# Altium project InductiveSensor_LDC1612.PrjPcb (part 1 of 2)
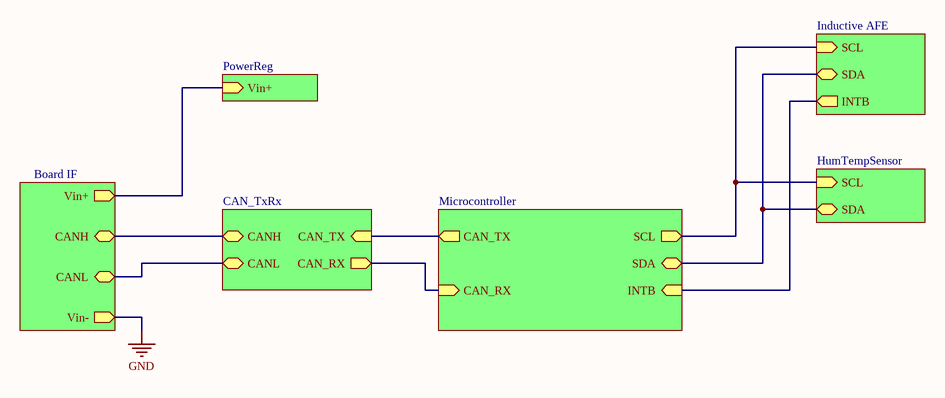
[diagram p0: Sheet1.SchDoc]
7 sheets, 55 parts. Net scope: global (net labels, ports and power ports of the same name join across sheets).
Board files: PCB1.PcbDoc, Coil_only_PCB1.PcbDoc
Sheets:
  Sheet1.SchDoc
    Inductive AFE = Sense_LDC1612.SchDoc
    Microcontroller = Microcontroller_STM32F04.SchDoc
    Board IF = BoardIF.SchDoc
    CAN_TxRx = CAN_TxRx.SchDoc
    PowerReg = PowerReg.SchDoc
    HumTempSensor = HumTempSensor.SchDoc

## Sheet Sheet1.SchDoc
size A; SheetNumber: 1; SheetTotal: 7

### Parts
FID1  Fiducial  [FID]  (value not drawn)
FID2  Fiducial  [FID]  (value not drawn)
FID3  Fiducial  [FID]  (value not drawn)

### Sub-sheets
Board IF = BoardIF.SchDoc: Vin+ (out), CANH (bidir), CANL (bidir), Vin- (out)
CAN_TxRx = CAN_TxRx.SchDoc: CANH (bidir), CANL (bidir), CAN_TX (in), CAN_RX (out)
HumTempSensor = HumTempSensor.SchDoc: SCL (in), SDA (bidir)
Inductive AFE = Sense_LDC1612.SchDoc: SCL (in), SDA (bidir), INTB (out)
Microcontroller = Microcontroller_STM32F04.SchDoc: SDA (bidir), SCL (out), CAN_TX (out), CAN_RX (in), INTB (in)
PowerReg = PowerReg.SchDoc: Vin+ (in)

### Nets
(unnamed): sheet Inductive AFE/SCL, sheet Microcontroller/SCL, sheet HumTempSensor/SCL
(unnamed): sheet Inductive AFE/SDA, sheet Microcontroller/SDA, sheet HumTempSensor/SDA
(unnamed): sheet Inductive AFE/INTB, sheet Microcontroller/INTB
(unnamed): sheet Microcontroller/CAN_TX, sheet CAN_TxRx/CAN_TX
(unnamed): sheet Microcontroller/CAN_RX, sheet CAN_TxRx/CAN_RX
(unnamed): sheet Board IF/Vin+, sheet PowerReg/Vin+
(unnamed): sheet Board IF/CANH, sheet CAN_TxRx/CANH
(unnamed): sheet Board IF/CANL, sheet CAN_TxRx/CANL

## Sheet Sense_LDC1612.SchDoc
size A; SheetNumber: 2; SheetTotal: 7
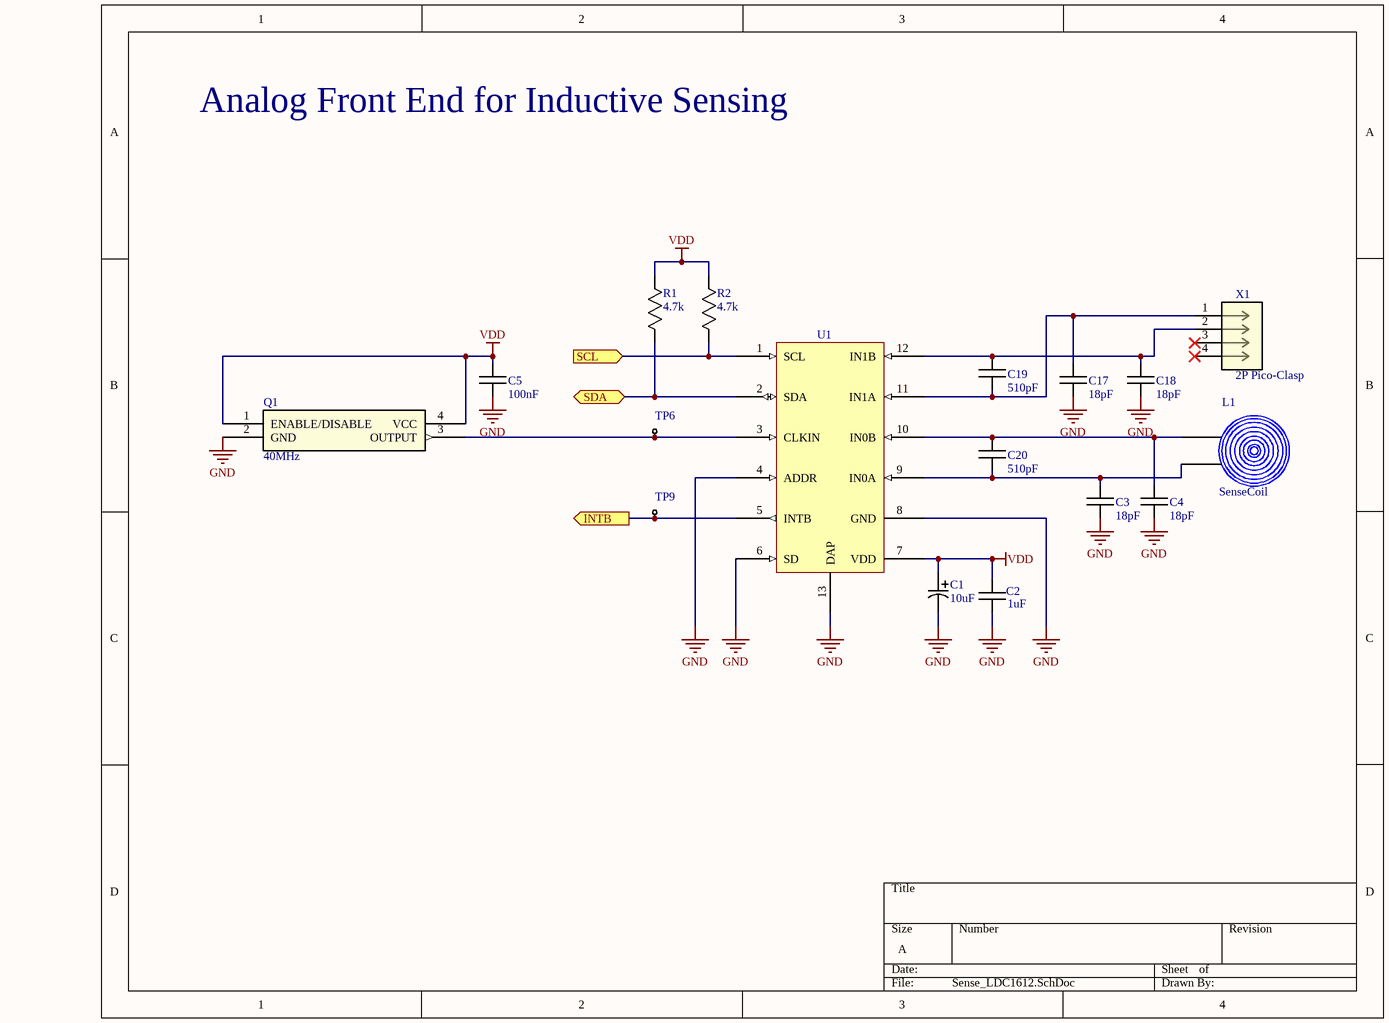
[diagram p1: Sense_LDC1612.SchDoc]

### Parts
C1  10uF  [CAP1206_TAJA]
C2  1uF  [CAP0805]
C3  18pF  [CAP0805]
C4  18pF  [CAP0805]
C5  100nF  [CAP0805]
C17  18pF  [CAP0805]
C18  18pF  [CAP0805]
C19  510pF  [CAP0805]
C20  510pF  [CAP0805]
L1  SenseCoil  [Coil_4L]
Q1  40MHz  [KC2520Z_KYO]
R1  4.7k  [RES0805]
R2  4.7k  [RES0805]
TP6  1mm Test Point  [TP_1MM]  (value not drawn)
TP9  1mm Test Point  [TP_1MM]  (value not drawn)
U1  Inductive Sensor 2Ch  [LDC1612]  (value not drawn)
X1  2P Pico-Clasp  [CON_2023960207]

### Ports
INTB (out, see Microcontroller_STM32F04[2B]), SCL (in, see HumTempSensor[3B], Microcontroller_STM32F04[1B]), SDA (bidir, see HumTempSensor[3B], Microcontroller_STM32F04[1B])

### Nets
GND: C1.2 C2.2 C3.2 C4.2 C5.2 C17.2 C18.2 Q1.2(GND) U1.4(ADDR) U1.6(SD) U1.8(GND) U1.13(DAP)
VDD: C1.1 C2.1 C5.1 Q1.1(ENABLE/DISABLE) Q1.4(VCC) R1.1 R2.1 U1.7(VDD)
NetC3_1: C3.1 C20.1 L1.1 U1.9(IN0A)
NetC4_1: C4.1 C20.2 L1.1 U1.10(IN0B)
NetC17_1: C17.1 C19.1 U1.11(IN1A) X1.1
NetC18_1: C18.1 C19.2 U1.12(IN1B) X1.2
NetQ1_3: Q1.3(OUTPUT) TP6.1 U1.3(CLKIN)
NetR1_2: R1.2 U1.2(SDA) ; port SDA
NetR2_2: R2.2 U1.1(SCL) ; port SCL
NetTP9_1: TP9.1 U1.5(INTB) ; port INTB

Not connected (* = marked no-connect by the designer): X1 3* 4*

### Notes on the sheet
- Analog Front End for Inductive Sensing

### Library data of the parts
C1 = TAJA106K016RNJ: Cap Tant Solid 10uF 16V A CASE 10%( 3.2 X 1.6 X 1.6mm) Inward L SMD 3216-18 3 Ohm 125C T/R; Mfr_Name: KYOCERA AVX; Type: DEV; Dielectric Material: Tantalum; Value: 10uF 16V 10% Tantalum; ESR (Equivalent Series Resistance): 3R; Leakage Current: 1.6uA; Dissipation Factor: 8%; Polarity: Polar; Frequency: 300MHz; Life (Hours): 2000Hour; Ripple Current: 158mA; Copyright: Copyright (C) 2023 Ultra Librarian. All rights reserved.; Manufacturer_Part_Number: TAJA106K016RNJ; RefDes: RefDes; Supplier: Digi-Key; Supplier Part Number: 478-1655-6-ND; Manufacturer: Kyocera AVX; Manufacturer Part Number: TAJA106K016RNJ; RoHS: Yes; Category: Tantalum Capacitors; Stock: 8878; Pricing: 1=0.35, 10=0.234, 50=0.1726, 100=0.1405, 500=0.1109, 1000=0.09365 (USD); Mounting Technology: Surface Mount,PCB; Case/Package: 1206; Pins: 2; Case Code (Metric): 3216; Case Code (Imperial): 1206; Min Operating Temperature: -55°C; Max Operating Temperature: 125°C; Tolerance: 10%; Packaging: Tape and Reel; Voltage Rating: 16V; Voltage Rating (DC): 16V; Features: General Purpose; Series: TAJ; Package Quantity: 1; Termination: SMD/SMT; Voltage: 16V; Construction: Flat; Voltage Rating (AC): 16V; Length: 3.2mm; Width: 1.6mm; Height: 1.6mm; Depth: 1.6mm; Height - Seated (Max): 0.071inch; Lead Pitch: 1.1mm; Size: 1.6mm; Radiation Hardening: No; Lead Free: Lead Free; RoHS Compliant: Yes; Reach SVHC Compliant: No; ComponentLink1URL: https://datasheet.ciiva.com/27051/1234933-27051768.pdf?src-supplier=Jameco; ComponentLink1Description: https://datasheet.ciiva.com/27051/1234933-27051768.pdf?src-supplier=Jameco; ComponentLink2URL: https://datasheet.ciiva.com/26341/559411-da-01-en-tacc-a-3-2-mm-x-1-6-mm-x-1-6-mm-10-uf-26341755.pdf?src-supplier=Conrad; ComponentLink2Description: https://datasheet.ciiva.com/26341/559411-da-01-en-tacc-a-3-2-mm-x-1-6-mm-x-1-6-mm-10-uf-26341755.pdf?src-supplier=Conrad; ComponentLink3URL: https://datasheet.ciiva.com/18710/taj-eng-18710622.pdf?src-supplier=Distrelec; ComponentLink3Description: https://datasheet.ciiva.com/18710/taj-eng-18710622.pdf?src-supplier=Distrelec; ComponentLink4URL: https://datasheet.ciiva.com/7730/1703059-7730712.pdf?src-supplier=Element14; ComponentLink4Description: https://datasheet.ciiva.com/7730/1703059-7730712.pdf?src-supplier=Element14; ComponentLink5URL: https://datasheet.ciiva.com/7730/1703059-7730713.pdf?src-supplier=Element14; ComponentLink5Description: https://datasheet.ciiva.com/7730/1703059-7730713.pdf?src-supplier=Element14; ComponentLink6URL: https://datasheet.ciiva.com/7730/taj-7730975.pdf?src-supplier=Element14; ComponentLink6Description: https://datasheet.ciiva.com/7730/taj-7730975.pdf?src-supplier=Element14; ComponentLink7URL: https://datasheet.ciiva.com/7730/1680476-7730714.pdf?src-supplier=Element14; ComponentLink7Description: https://datasheet.ciiva.com/7730/1680476-7730714.pdf?src-supplier=Element14; ComponentLink8URL: https://datasheet.ciiva.com/263/taj-263392.pdf?src-supplier=Digi-Key; ComponentLink8Description: https://datasheet.ciiva.com/263/taj-263392.pdf?src-supplier=Digi-Key; ComponentLink9URL: https://datasheet.ciiva.com/263/taj-263391.pdf?src-supplier=Digi-Key; ComponentLink9Description: https://datasheet.ciiva.com/263/taj-263391.pdf?src-supplier=Digi-Key; ComponentLink10URL: https://datasheet.ciiva.com/263/taj-263393.pdf?src-supplier=Digi-Key; ComponentLink10Description: https://datasheet.ciiva.com/263/taj-263393.pdf?src-supplier=Digi-Key; ComponentLink11URL: https://datasheet.ciiva.com/12882/taj-27497-12882509.pdf?src-supplier=Mouser; ComponentLink11Description: https://datasheet.ciiva.com/12882/taj-27497-12882509.pdf?src-supplier=Mouser; ComponentLink12URL: https://datasheet.ciiva.com/3004/taj-3004388.pdf?src-supplier=Avnet; ComponentLink12Description: https://datasheet.ciiva.com/3004/taj-3004388.pdf?src-supplier=Avnet; ComponentLink13URL: https://datasheet.ciiva.com/16379/taj-16379015.pdf?src-supplier=Future+Electronics; ComponentLink13Description: https://datasheet.ciiva.com/16379/taj-16379015.pdf?src-supplier=Future+Electronics; ComponentLink14URL: https://datasheet.ciiva.com/3004/taj-3004387.pdf?src-supplier=Avnet; ComponentLink14Description: https://datasheet.ciiva.com/3004/taj-3004387.pdf?src-supplier=Avnet; LCSC Part#: C7171
C2 = CL21B105KBFNNNE: Multilayer Ceramic Capacitor, 1 uF, 50 V, ± 10%, X7R, 0805 [2012 Metric]; Manufacturer: Samsung; Value: 1uF 50V; Voltage Rating: 50V; Dielectric Material: Tantalum; Temperature Coefficient: 0ppm/°C; Supplier: Digi-Key; Supplier Part Number: 1276-1029-1-ND; Manufacturer Part Number: CL21B105KBFNNNE; RoHS: Yes; Category: Ceramic Capacitors; Stock: 1577316; Pricing: 1=0.11, 10=0.075, 50=0.045, 100=0.0354, 500=0.02616, 1000=0.02165 (USD); Mounting Technology: Surface Mount; Case/Package: 0805; Case Code (Metric): 2012; Case Code (Imperial): 0805; Material: Ceramic; Min Operating Temperature: -55°C; Max Operating Temperature: 125°C; Tolerance: 10%; Packaging: Tape and Reel; Package Quantity: 1; Dielectric: X7R; Voltage: 50V; Series: CL; Construction: Flat; Voltage Rating (DC): 50V; Length: 2mm; Width: 0.049inch; Height: 1.25mm; Thickness: 0.053inch; Depth: 1.25mm; Radiation Hardening: No; RoHS Compliant: Yes; ComponentLink1URL: https://datasheet.ciiva.com/25800/cl21b105kbfnnne-25800291.pdf?src-supplier=Digi-Key; ComponentLink1Description: https://datasheet.ciiva.com/25800/cl21b105kbfnnne-25800291.pdf?src-supplier=Digi-Key; Pins: 2; Termination: SMD/SMT; Lead Free: Lead Free; ComponentLink2URL: https://datasheet.ciiva.com/16511/vjw1bcbascomseries-16511277.pdf?src-supplier=Future+Electronics; ComponentLink2Description: https://datasheet.ciiva.com/16511/vjw1bcbascomseries-16511277.pdf?src-supplier=Future+Electronics; ComponentLink3URL: https://datasheet.ciiva.com/176/vjw1bcbascomseries-176732.pdf?src-supplier=Digi-Key; ComponentLink3Description: https://datasheet.ciiva.com/176/vjw1bcbascomseries-176732.pdf?src-supplier=Digi-Key; LCSC Part#: C28323
C3 C4 C17 C18 = VJ0805A180JXACW1BC: 0805 18 pF 50 V ±5 % Tolerance C0G/NP0 SMT Multilayer Ceramic Chip Capacitor; Manufacturer: Vishay; Dielectric Material: Tantalum; Tolerance: 5%; Voltage Rating: 50V; Dielectric: C0G; Temperature Coefficient: 0ppm/°C; Supplier: Digi-Key; Supplier Part Number: 720-1628-1-ND; Manufacturer Part Number: VJ0805A180JXACW1BC; RoHS: Yes; Category: Ceramic Capacitors; Stock: 4074; Pricing: 1=0.2, 10=0.132, 50=0.079, 100=0.0622, 500=0.0459, 1000=0.038 (USD); Mounting Technology: Surface Mount; Case/Package: 0805; Pins: 2; Case Code (Imperial): 0805; Case Code (Metric): 2012; Min Operating Temperature: -55°C; Max Operating Temperature: 125°C; Value: 18pF 50V; Voltage Rating (DC): 50V; Packaging: Tape and Reel; Package Quantity: 4000; Termination: SMD/SMT; Series: VJ; Construction: Flat; Length: 2mm; Width: 1.25mm; Height: 1.45mm; Thickness: 0.03inch; Depth: 1.25mm; Radiation Hardening: No; Lead Free: Lead Free; RoHS Compliant: Yes; ComponentLink1URL: https://datasheet.ciiva.com/16511/vjw1bcbascomseries-16511277.pdf?src-supplier=Future+Electronics; ComponentLink1Description: https://datasheet.ciiva.com/16511/vjw1bcbascomseries-16511277.pdf?src-supplier=Future+Electronics; ComponentLink2URL: https://datasheet.ciiva.com/176/vjw1bcbascomseries-176732.pdf?src-supplier=Digi-Key; ComponentLink2Description: https://datasheet.ciiva.com/176/vjw1bcbascomseries-176732.pdf?src-supplier=Digi-Key; LCSC Part#: C2174299
C5 = CC0805KRX7R9BB104: Multilayer Ceramic Capacitor, 0.1 uF, 50 V, ± 10%, X7R, 0805 [2012 Metric]; Manufacturer: Yageo; Value: 100nF 50V; Voltage: 50V; Insulation Resistance: 100GR; Supplier: Digi-Key; Supplier Part Number: 311-1140-1-ND; Manufacturer Part Number: CC0805KRX7R9BB104; RoHS: Yes; Category: Ceramic Capacitors; Stock: 6426664; Pricing: 1=0.1, 10=0.07, 50=0.0418, 100=0.0329, 500=0.02428, 1000=0.0201 (USD); Mounting Technology: Surface Mount; Case/Package: 0805; Pins: 2; Case Code (Metric): 2012; Case Code (Imperial): 0805; Material: Ceramic; Min Operating Temperature: -55°C; Max Operating Temperature: 125°C; Tolerance: 10%; Dielectric: X7R; Packaging: Tape and Reel; Voltage Rating: 50V; Package Quantity: 4000; Termination: SMD/SMT; Series: CC; Length: 2mm; Height: 0.85mm; Depth: 1.25mm; Radiation Hardening: No; RoHS Compliant: Yes; Reach SVHC Compliant: No; Lead Free: Lead Free; Halogen Free: Halogen Free; ComponentLink1URL: https://datasheet.ciiva.com/11786/0900766b80d84f1d-11786009.pdf?src-supplier=Rs; ComponentLink1Description: https://datasheet.ciiva.com/11786/0900766b80d84f1d-11786009.pdf?src-supplier=Rs; ComponentLink2URL: https://datasheet.ciiva.com/46393/1734573-46393307.pdf?src-supplier=Element14; ComponentLink2Description: https://datasheet.ciiva.com/46393/1734573-46393307.pdf?src-supplier=Element14; ComponentLink3URL: https://datasheet.ciiva.com/155/mlccorderingcode-155930.pdf?src-supplier=Digi-Key; ComponentLink3Description: https://datasheet.ciiva.com/155/mlccorderingcode-155930.pdf?src-supplier=Digi-Key; ComponentLink4URL: https://datasheet.ciiva.com/155/mlccorderingcode-155929.pdf?src-supplier=Digi-Key; ComponentLink4Description: https://datasheet.ciiva.com/155/mlccorderingcode-155929.pdf?src-supplier=Digi-Key; ComponentLink5URL: https://datasheet.ciiva.com/155/mlccorderingcode-155931.pdf?src-supplier=Digi-Key; ComponentLink5Description: https://datasheet.ciiva.com/155/mlccorderingcode-155931.pdf?src-supplier=Digi-Key; ComponentLink6URL: https://datasheet.ciiva.com/11464/upy-gphc-x7r-6-3v-to-50v-8-11464757.pdf?src-supplier=Avnet; ComponentLink6Description: https://datasheet.ciiva.com/11464/upy-gphc-x7r-6-3v-to-50v-8-11464757.pdf?src-supplier=Avnet; ComponentLink7URL: https://datasheet.ciiva.com/28450/1489800-28450805.pdf?src-supplier=Element14; ComponentLink7Description: https://datasheet.ciiva.com/28450/1489800-28450805.pdf?src-supplier=Element14; ComponentLink8URL: https://datasheet.ciiva.com/29242/445210-da-01-en-kerko-chip-0805-x7r-0-1uf-10proz-50vg-29242074.pdf?src-supplier=Conrad; ComponentLink8Description: https://datasheet.ciiva.com/29242/445210-da-01-en-kerko-chip-0805-x7r-0-1uf-10proz-50vg-29242074.pdf?src-supplier=Conrad; LCSC Part#: C49678
C19 C20 = CC0805JRNPO9BN511: 0805 510 pF 50 V ±5 % Tolerance NP0 SMT Multilayer Ceramic Capacitor; Manufacturer: Yageo; Tolerance: 5%; Voltage Rating (DC): 50V; Supplier: Digi-Key; Supplier Part Number: 311-4240-1-ND; Manufacturer Part Number: CC0805JRNPO9BN511; RoHS: Yes; Category: Ceramic Capacitors; Stock: 4065; Pricing: 1=0.18, 10=0.119, 50=0.071, 100=0.0559, 500=0.04124, 1000=0.03415 (USD); Mounting Technology: Surface Mount; Case/Package: 0805; Case Code (Imperial): 0805; Case Code (Metric): 2012; Weight: 0.000194oz; Min Operating Temperature: -55°C; Max Operating Temperature: 125°C; Value: 510pF 50V; Packaging: Tape and Reel; Voltage Rating: 50V; Dielectric: NP0; Termination: SMD/SMT; Series: CC; Length: 0.079inch; Width: 0.049inch; Thickness: 0.028inch; Lead Free: Lead Free; ComponentLink1URL: http://www.mouser.com/ds/2/447/Yageo_UPY-GP_NP0_16V-to-50V_9-358835.pdf?src-supplier=Mouser; ComponentLink1Description: http://www.mouser.com/ds/2/447/Yageo_UPY-GP_NP0_16V-to-50V_9-358835.pdf?src-supplier=Mouser; ComponentLink2URL: https://www.yageo.com/upload/media/product/productsearch/datasheet/mlcc/UPY-GP_NP0_16V-to-50V_18.pdf?src-supplier=Digi-Key; ComponentLink2Description: https://www.yageo.com/upload/media/product/productsearch/datasheet/mlcc/UPY-GP_NP0_16V-to-50V_18.pdf?src-supplier=Digi-Key; ComponentLink3URL: http://www.yageo.com/documents/recent/UPY-GP_NP0_16V-to-50V_16.pdf?src-supplier=Digi-Key; ComponentLink3Description: http://www.yageo.com/documents/recent/UPY-GP_NP0_16V-to-50V_16.pdf?src-supplier=Digi-Key; ComponentLink4URL: http://www.yageo.com/exep/pages/download/literatures/ProductSelectionGuide%202014_Final_2.pdf?src-supplier=Digi-Key; ComponentLink4Description: http://www.yageo.com/exep/pages/download/literatures/ProductSelectionGuide%202014_Final_2.pdf?src-supplier=Digi-Key; ComponentLink5URL: http://www.yageo.com/documents/recent/UPY-GP_NP0_16V-to-50V_9.pdf?src-supplier=Future+Electronics; ComponentLink5Description: http://www.yageo.com/documents/recent/UPY-GP_NP0_16V-to-50V_9.pdf?src-supplier=Future+Electronics; ComponentLink6URL: https://datasheet.octopart.com/CC0805JRNPO9BN511-Yageo-datasheet-151948684.pdf?src-supplier=Newark; ComponentLink6Description: https://datasheet.octopart.com/CC0805JRNPO9BN511-Yageo-datasheet-151948684.pdf?src-supplier=Newark; LCSC Part#: C309486
Q1 = KC2520Z40.0000C15XXK: Xtal Osc Xo 40.0000MHZ Cmos SMD; Manufacturer: Kyocera AVX; Supplier: Digi-Key; Supplier Part Number: 478-KC2520Z40.0000C15XXKCT-ND; Manufacturer Part Number: KC2520Z40.0000C15XXK; RoHS: No; Category: Oscillators; Stock: 9175; Pricing: 1=1.16, 10=1.107, 50=1.0816, 100=0.927, 500=0.90124, 1000=0.75962 (USD); LCSC Part#: C1857241; Value: KC2520Z40.0000C15XXK
R1 R2 = ERJ-6GEYJ472V: Res Thick Film 0805 4.7K Ohm 5% 1/8W ±200ppm/°C Molded SMD Punched Carrier T/R; Manufacturer: Panasonic; Value: 4.7kR; Power Rating: 125mW; Voltage Rating: 150V; Supplier: Digi-Key; Supplier Part Number: P4.7KACT-ND; Manufacturer Part Number: ERJ-6GEYJ472V; RoHS: Yes; Category: Chip SMD Resistors; Stock: 148739; Pricing: 1=0.1, 10=0.038, 50=0.0244, 100=0.0206, 500=0.01434, 1000=0.01248 (USD); Mounting Technology: Surface Mount; Case/Package: 0805; Case Code (Metric): 2012; Case Code (Imperial): 0805; Contact Plating: Tin; Min Operating Temperature: -55°C; Max Operating Temperature: 155°C; Tolerance: 5%; Packaging: Tape and Reel; Package Quantity: 1; Termination: SMD/SMT; Max Power Dissipation: 125mW; Series: ERJ; Resistance Tolerance: 5%; Resistor Type: Thick Film; Number of Terminations: 2; Temperature Coefficient: 200ppm/°C; Construction: Rectangular; Technology: THICK FILM; Voltage Rating (DC): 150V; Length: 2mm; Width: 1.25mm; Height: 0.6mm; Depth: 1.25mm; Radiation Hardening: No; Reach SVHC Compliant: No; RoHS Compliant: Yes; Military Standard: Not; Lead Free: Lead Free; LCSC Part#: C230645
TP6 TP9 = TestPoint_1mm
U1 = LDC1612: 2-Ch, 28-bit, high-resolution Inductance to digital converter 12-WSON -40 to 125; Manufacturer: Texas Instruments; Manufacturer Part Number: LDC1612DNTR; Interface: I2C; Number of Inputs: 2; Value: LDC1612DNTR; Package: WSON-12; Supplier: Digi-Key; Supplier Part Number: 296-LDC1612DNCT-ND; RoHS: Yes; Category: Integrated Circuits (ICs); Stock: 21433; Pricing: 1=3.68, 10=3.305, 25=3.1248, 100=2.7081, 250=2.5692, 500=2.30532, 1000=1.94425 (USD); Mounting Technology: Surface Mount; Pins: 12; Min Operating Temperature: -40°C; Max Operating Temperature: 125°C; Series: *; Packaging: Tape and Reel; Number of Channels: 2; Lead Free: Lead Free; RoHS Compliant: Yes; ComponentLink2URL: http://www.ti.com/general/docs/suppproductinfo.tsp?distId=10&amp;gotoUrl=http%3A%2F%2Fwww.ti.com%2Flit%2Fgpn%2Fldc1612&src-supplier=Digi-Key; ComponentLink2Description: http://www.ti.com/general/docs/suppproductinfo.tsp?distId=10&amp;gotoUrl=http%3A%2F%2Fwww.ti.com%2Flit%2Fgpn%2Fldc1612&src-supplier=Digi-Key; ComponentLink3URL: http://www.ti.com/general/docs/lit/getliterature.tsp?genericPartNumber=LDC1614&&fileType=pdf&src-supplier=Avnet; ComponentLink3Description: http://www.ti.com/general/docs/lit/getliterature.tsp?genericPartNumber=LDC1614&&fileType=pdf&src-supplier=Avnet; ComponentLink4URL: http://www.ti.com/lit/gpn/ldc1612?src-supplier=Mouser; ComponentLink4Description: http://www.ti.com/lit/gpn/ldc1612?src-supplier=Mouser; LCSC Part#: C1847959
X1 = 202396-0207: Conn Shrouded Header (4 Sides) HDR 2 POS 1mm Solder RA Side Entry SMD Pico-Clasp™ T/R; Manufacturer: Molex; Number of Positions: 2; Value: 2023960207; Supplier: Digi-Key; Supplier Part Number: WM26783CT-ND; Manufacturer Part Number: 202396-0207; RoHS: No; Category: Headers and Wire Housings; Stock: 6710; Pricing: 1=0.97, 10=0.804, 100=0.6698 (USD); Mounting Technology: Surface Mount; Contact Material: Bronze; Contact Shape: Square; Insulation Material: Nylon; Insulation Color: Natural; Contact Finish - Mating: GOLD; Min Operating Temperature: -40°C; Max Operating Temperature: 105°C; Connector Type: Header; Fastening Type: Latch; Packaging: Tape and Reel; Number of Rows: 1; Termination: Solder; Series: Pico-Clasp 202396; Contact Type: Male Pin; Flammability Rating: UL94 V-0; ComponentLink1URL: http://datasheet.octopart.com/2023960207-Molex-datasheet-147952241.pdf?src-supplier=Digi-Key; ComponentLink1Description: http://datasheet.octopart.com/2023960207-Molex-datasheet-147952241.pdf?src-supplier=Digi-Key; ComponentLink2URL: https://www.molex.com/pdm_docs/sd/2023960207_sd.pdf?src-supplier=Digi-Key; ComponentLink2Description: https://www.molex.com/pdm_docs/sd/2023960207_sd.pdf?src-supplier=Digi-Key; ComponentLink3URL: http://datasheet.octopart.com/2023960207-Molex-datasheet-147952241.pdf?src-supplier=Newark; ComponentLink3Description: http://datasheet.octopart.com/2023960207-Molex-datasheet-147952241.pdf?src-supplier=Newark; ComponentLink4URL: http://datasheet.octopart.com/2023960207-Molex-datasheet-147952241.pdf?src-supplier=Farnell; ComponentLink4Description: http://datasheet.octopart.com/2023960207-Molex-datasheet-147952241.pdf?src-supplier=Farnell; ComponentLink5URL: http://datasheet.octopart.com/2023960207-Molex-datasheet-147952241.pdf?src-supplier=Avnet; ComponentLink5Description: http://datasheet.octopart.com/2023960207-Molex-datasheet-147952241.pdf?src-supplier=Avnet; ComponentLink6URL: http://datasheet.octopart.com/2023960207-Molex-datasheet-147952241.pdf?src-supplier=Arrow+Electronics; ComponentLink6Description: http://datasheet.octopart.com/2023960207-Molex-datasheet-147952241.pdf?src-supplier=Arrow+Electronics; ComponentLink7URL: http://datasheet.octopart.com/2023960207-Molex-datasheet-147952241.pdf?src-supplier=TTI; ComponentLink7Description: http://datasheet.octopart.com/2023960207-Molex-datasheet-147952241.pdf?src-supplier=TTI; ComponentLink8URL: http://datasheet.octopart.com/2023960207-Molex-datasheet-147952241.pdf?src-supplier=Electro+Sonic; ComponentLink8Description: http://datasheet.octopart.com/2023960207-Molex-datasheet-147952241.pdf?src-supplier=Electro+Sonic; ComponentLink9URL: https://datasheet.octopart.com/202396-0207-Molex-datasheet-134623761.pdf?src-supplier=TME; ComponentLink9Description: https://datasheet.octopart.com/202396-0207-Molex-datasheet-134623761.pdf?src-supplier=TME; LCSC Part#: C585325

## Sheet Microcontroller_STM32F04.SchDoc
size A; SheetNumber: 3; SheetTotal: 7
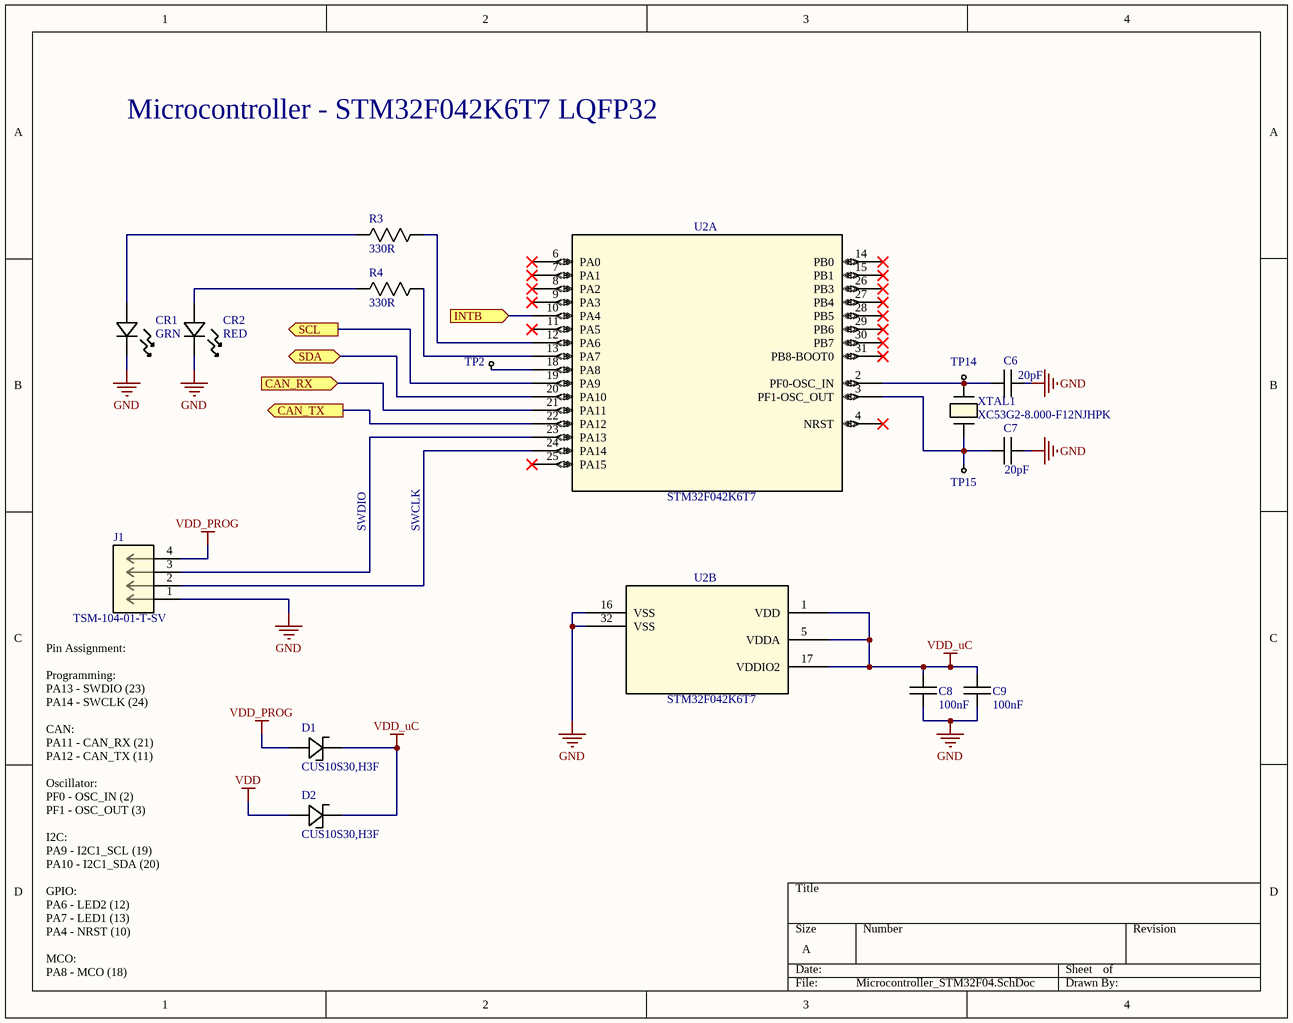
[diagram p2: Microcontroller_STM32F04.SchDoc]

### Parts
C6  20pF  [C0603]
C7  20pF  [C0603]
C8  100nF  [CAP0805]
C9  100nF  [CAP0805]
CR1  GRN  [LED_VISHAY_VLMX1300_VIS]
CR2  RED  [LED_VISHAY_VLMX1300_VIS]
D1  CUS10S30,H3F  [USC_TOS]
D2  CUS10S30,H3F  [USC_TOS]
J1  TSM-104-01-T-SV  [CONN_TSM-104-01-T-SV_SAI]
R3  330R  [R0603]
R4  330R  [R0603]
TP2  1mm Test Point  [TP_1MM]  (value not drawn)
TP14  1mm Test Point  [TP_1MM]  (value not drawn)
TP15  1mm Test Point  [TP_1MM]  (value not drawn)
U2  STM32F042K6T7  [LQFP-32]  (parts A,B of 2)
XTAL1  XC53G2-8.000-F12NJHPK  [XTAL_NX5032_NDK]

### Ports
CAN_RX (in, see CAN_TxRx[2B]), CAN_TX (out, see CAN_TxRx[2B]), INTB (in, see Sense_LDC1612[2C]), SCL (out, see HumTempSensor[3B], Sense_LDC1612[2B]), SDA (bidir, see HumTempSensor[3B], Sense_LDC1612[2B])

### Nets
GND: C6.1 C7.1 C8.2 C9.2 CR1.1 CR2.1 J1.1 U2.16(VSS) U2.32(VSS)
VDD: D2.2(anode)
VDD_PROG: D1.2(anode) J1.4
VDD_uC: C8.1 C9.1 D1.1(cathode) D2.1(cathode) U2.1(VDD) U2.5(VDDA) U2.17(VDDIO2)
NetC6_2: C6.2 TP14.1 U2.2(PF0-OSC_IN) XTAL1.2
NetC7_2: C7.2 TP15.1 U2.3(PF1-OSC_OUT) XTAL1.1
NetCR1_2: CR1.2 R3.2
NetCR2_2: CR2.2 R4.2
NetJ1_2: J1.2 U2.24(PA14)
NetJ1_3: J1.3 U2.23(PA13)
NetR1_2: U2.20(PA10) ; port SDA
NetR2_2: U2.19(PA9) ; port SCL
NetR3_1: R3.1 U2.12(PA6)
NetR4_1: R4.1 U2.13(PA7)
NetTP2_1: TP2.1 U2.18(PA8)
NetTP9_1: U2.10(PA4) ; port INTB
NetTP20_1: U2.21(PA11) ; port CAN_RX
NetTP26_1: U2.22(PA12) ; port CAN_TX

Not connected (* = marked no-connect by the designer): U2 4(NRST)* 6(PA0)* 7(PA1)* 8(PA2)* 9(PA3)* 11(PA5)* 14(PB0)* 15(PB1)* 25(PA15)* 26(PB3)* 27(PB4)* 28(PB5)* 29(PB6)* 30(PB7)* 31(PB8-BOOT0)*

### Notes on the sheet
- Microcontroller - STM32F042K6T7 LQFP32
- SWDIO
- SWCLK
- (near J1) Pin Assignment:
  Programming:
  PA13 - SWDIO (23)
  PA14 - SWCLK (24)
  CAN:
  PA11 - CAN_RX (21)
  PA12 - CAN_TX (11)
  Oscillator:
  PF0 - OSC_IN (2)
  PF1 - OSC_OUT (3)
  I2C:
  PA9 - I2C1_SCL (19)
  PA10 - I2C1_SDA (20)
  GPIO:
  PA6 - LED2 (12)
  PA7 - LED1 (13)
  PA4 - NRST (10)
  MCO:
  PA8 - MCO (18)

### Library data of the parts
C6 C7 = CL10C200JB8NNNC: Multilayer Ceramic Capacitor, 20 pF, 50 V, ± 5%, C0G (NP0), 0603 [1608 Metric]; Manufacturer: Samsung; Value: 20pF 50V; Voltage Rating: 50V; Temperature Coefficient: 300ppm/°C; Supplier: Digi-Key; Supplier Part Number: 1276-1187-1-ND; Manufacturer Part Number: CL10C200JB8NNNC; RoHS: Yes; Category: Ceramic Capacitors; Stock: 379574; Pricing: 1=0.1, 10=0.041, 50=0.0238, 100=0.0184, 500=0.01386, 1000=0.01089 (USD); Mounting Technology: Surface Mount; Case/Package: 0603; Case Code (Metric): 1608; Case Code (Imperial): 0603; Min Operating Temperature: -55°C; Max Operating Temperature: 125°C; Tolerance: 5%; Dielectric: C0G; Package Quantity: 1; Packaging: Tape and Reel; Voltage: 50V; Series: CL; Construction: Flat; Voltage Rating (DC): 50V; Length: 1.6mm; Width: 0.031inch; Height: 0.8mm; Thickness: 0.035inch; Depth: 0.8mm; Radiation Hardening: No; RoHS Compliant: Yes; ComponentLink1URL: https://datasheet.ciiva.com/26877/getdatasheetpartid-640634-26877974.pdf?src-supplier=Verical; ComponentLink1Description: https://datasheet.ciiva.com/26877/getdatasheetpartid-640634-26877974.pdf?src-supplier=Verical; ComponentLink2URL: https://datasheet.ciiva.com/26310/mlcc-catalogdownload2013-eng-26310315.pdf?src-supplier=Distrelec; ComponentLink2Description: https://datasheet.ciiva.com/26310/mlcc-catalogdownload2013-eng-26310315.pdf?src-supplier=Distrelec; LCSC Part#: C1648
C8 C9 = CC0805KRX7R9BB104: as C5 on sheet Sense_LDC1612; Supplier: Digi-Key; Supplier Part Number: 311-1140-1-ND; Manufacturer Part Number: CC0805KRX7R9BB104; RoHS: Yes; Category: Ceramic Capacitors; Stock: 6426664; Pricing: 1=0.1, 10=0.07, 50=0.0418, 100=0.0329, 500=0.02428, 1000=0.0201 (USD); Mounting Technology: Surface Mount; Case/Package: 0805; Pins: 2; Case Code (Metric): 2012; Case Code (Imperial): 0805; Material: Ceramic; Min Operating Temperature: -55°C; Max Operating Temperature: 125°C; Tolerance: 10%; Dielectric: X7R; Packaging: Tape and Reel; Voltage Rating: 50V; Package Quantity: 4000; Termination: SMD/SMT; Series: CC; Length: 2mm; Height: 0.85mm; Depth: 1.25mm; Radiation Hardening: No; RoHS Compliant: Yes; Reach SVHC Compliant: No; Lead Free: Lead Free; Halogen Free: Halogen Free; ComponentLink1URL: https://datasheet.ciiva.com/11786/0900766b80d84f1d-11786009.pdf?src-supplier=Rs; ComponentLink1Description: https://datasheet.ciiva.com/11786/0900766b80d84f1d-11786009.pdf?src-supplier=Rs; ComponentLink2URL: https://datasheet.ciiva.com/46393/1734573-46393307.pdf?src-supplier=Element14; ComponentLink2Description: https://datasheet.ciiva.com/46393/1734573-46393307.pdf?src-supplier=Element14; ComponentLink3URL: https://datasheet.ciiva.com/155/mlccorderingcode-155930.pdf?src-supplier=Digi-Key; ComponentLink3Description: https://datasheet.ciiva.com/155/mlccorderingcode-155930.pdf?src-supplier=Digi-Key; ComponentLink4URL: https://datasheet.ciiva.com/155/mlccorderingcode-155929.pdf?src-supplier=Digi-Key; ComponentLink4Description: https://datasheet.ciiva.com/155/mlccorderingcode-155929.pdf?src-supplier=Digi-Key; ComponentLink5URL: https://datasheet.ciiva.com/155/mlccorderingcode-155931.pdf?src-supplier=Digi-Key; ComponentLink5Description: https://datasheet.ciiva.com/155/mlccorderingcode-155931.pdf?src-supplier=Digi-Key; ComponentLink6URL: https://datasheet.ciiva.com/11464/upy-gphc-x7r-6-3v-to-50v-8-11464757.pdf?src-supplier=Avnet; ComponentLink6Description: https://datasheet.ciiva.com/11464/upy-gphc-x7r-6-3v-to-50v-8-11464757.pdf?src-supplier=Avnet; ComponentLink7URL: https://datasheet.ciiva.com/28450/1489800-28450805.pdf?src-supplier=Element14; ComponentLink7Description: https://datasheet.ciiva.com/28450/1489800-28450805.pdf?src-supplier=Element14; ComponentLink8URL: https://datasheet.ciiva.com/29242/445210-da-01-en-kerko-chip-0805-x7r-0-1uf-10proz-50vg-29242074.pdf?src-supplier=Conrad; ComponentLink8Description: https://datasheet.ciiva.com/29242/445210-da-01-en-kerko-chip-0805-x7r-0-1uf-10proz-50vg-29242074.pdf?src-supplier=Conrad; LCSC Part#: C49678
CR1 = VLMG1300-GS08: LED Uni-Color Yellow Green 574nm 2-Pin Chip 0603(1608Metric) T/R; Mfr_Name: Vishay; Manufacturer: Vishay Semiconductors; Type: DEV; Color: Green,Yellow; Lens Style: Rectangular,Clear; Forward Voltage: 2V; Viewing Angle: 130°; Luminous Intensity: 35mcd; Forward Current: 20mA; Wavelength: 571nm; Power Rating: 75mW; Number of Elements: 1; Reverse Voltage: 5V; Value: LED Green; Copyright: Copyright (C) 2023 Ultra Librarian. All rights reserved.; Manufacturer_Part_Number: VLMG1300-GS08; RefDes: RefDes; Supplier: Digi-Key; Supplier Part Number: VLMG1300-GS08CT-ND; Manufacturer Part Number: VLMG1300-GS08; RoHS: Yes; Category: LEDs; Stock: 55201; Pricing: 1=0.3, 10=0.237, 100=0.1065, 500=0.09616, 1000=0.07898 (USD); Mounting Technology: Surface Mount; Case/Package: 0603; Pins: 2; Case Code (Metric): 1608; Case Code (Imperial): 0603; Min Operating Temperature: -35°C; Max Operating Temperature: 85°C; Packaging: Tape and Reel; Illumination Color: Green,Yellow; Package Quantity: 1; Dominant Wavelength: 571nm; Test Current: 20mA; Power Dissipation: 75mW; Number of LEDs: 1; Series: CHipLED; Length: 1.6mm; Width: 0.8mm; Height: 0.8mm; Depth: 0.8mm; Radiation Hardening: No; Lead Free: Lead Free; RoHS Compliant: Yes; Reach SVHC Compliant: Unknown; ComponentLink1URL: https://datasheet.ciiva.com/26322/vlmo1300-26322139.pdf?src-supplier=Element14; ComponentLink1Description: https://datasheet.ciiva.com/26322/vlmo1300-26322139.pdf?src-supplier=Element14; ComponentLink2URL: https://datasheet.ciiva.com/26322/vlmo1300-26322140.pdf?src-supplier=Element14; ComponentLink2Description: https://datasheet.ciiva.com/26322/vlmo1300-26322140.pdf?src-supplier=Element14; ComponentLink3URL: https://datasheet.ciiva.com/8028/vlmo1300-8028023.pdf?src-supplier=Element14; ComponentLink3Description: https://datasheet.ciiva.com/8028/vlmo1300-8028023.pdf?src-supplier=Element14; ComponentLink4URL: https://datasheet.ciiva.com/9333/vlmo1300-9333390.pdf?src-supplier=Avnet; ComponentLink4Description: https://datasheet.ciiva.com/9333/vlmo1300-9333390.pdf?src-supplier=Avnet; LCSC Part#: C4749244
CR2 = VLMS1300-GS08: LED RED 0603 SMD; Mfr_Name: Vishay; Manufacturer: Vishay Semiconductors; Type: DEV; Viewing Angle: 130°; Lens Style: Rectangular,Clear; Number of LEDs: 1; Luminous Intensity: 54mcd; Forward Voltage: 2V; Wavelength: 631nm; Forward Current: 20mA; Power Rating: 75mW; Value: LED Red; Copyright: Copyright (C) 2023 Ultra Librarian. All rights reserved.; Manufacturer_Part_Number: VLMS1300-GS08; RefDes: RefDes; Supplier: Digi-Key; Supplier Part Number: VLMS1300-GS08CT-ND; Manufacturer Part Number: VLMS1300-GS08; RoHS: Yes; Category: LEDs; Stock: 28800; Pricing: 1=0.28, 10=0.223, 100=0.1002, 500=0.0905, 1000=0.07434 (USD); Mounting Technology: Surface Mount; Case/Package: 0603; Color: Red; Case Code (Metric): 1608; Case Code (Imperial): 0603; Min Operating Temperature: -35°C; Max Operating Temperature: 85°C; Package Quantity: 1; Packaging: Tape and Reel; Illumination Color: Red; Dominant Wavelength: 631nm; Test Current: 20mA; Series: CHipLED; Length: 1.6mm; Width: 0.8mm; Height: 0.8mm; Radiation Hardening: No; Lead Free: Lead Free; RoHS Compliant: Yes; Reach SVHC Compliant: Unknown; ComponentLink1URL: https://datasheet.ciiva.com/26322/vlmo1300-26322153.pdf?src-supplier=Element14; ComponentLink1Description: https://datasheet.ciiva.com/26322/vlmo1300-26322153.pdf?src-supplier=Element14; ComponentLink2URL: https://datasheet.ciiva.com/8028/vlmo1300-8028047.pdf?src-supplier=Element14; ComponentLink2Description: https://datasheet.ciiva.com/8028/vlmo1300-8028047.pdf?src-supplier=Element14; ComponentLink3URL: https://datasheet.ciiva.com/9333/vlmo1300-9333743.pdf?src-supplier=Avnet; ComponentLink3Description: https://datasheet.ciiva.com/9333/vlmo1300-9333743.pdf?src-supplier=Avnet; ComponentLink4URL: https://datasheet.ciiva.com/16510/vlmo1300-16510985.pdf?src-supplier=Future+Electronics; ComponentLink4Description: https://datasheet.ciiva.com/16510/vlmo1300-16510985.pdf?src-supplier=Future+Electronics; ComponentLink5URL: https://datasheet.ciiva.com/2114/vlmo1300-2114930.pdf?src-supplier=Digi-Key; ComponentLink5Description: https://datasheet.ciiva.com/2114/vlmo1300-2114930.pdf?src-supplier=Digi-Key; ComponentLink6URL: https://datasheet.ciiva.com/2114/vlmo1300-2114931.pdf?src-supplier=Digi-Key; ComponentLink6Description: https://datasheet.ciiva.com/2114/vlmo1300-2114931.pdf?src-supplier=Digi-Key; ComponentLink7URL: https://datasheet.ciiva.com/2114/vlmo1300-2114929.pdf?src-supplier=Digi-Key; ComponentLink7Description: https://datasheet.ciiva.com/2114/vlmo1300-2114929.pdf?src-supplier=Digi-Key; LCSC Part#: C83242
D1 D2 = CUS10S30,H3F: Rectifier Diode, Schottky, 1 Phase, 1 Element, 1A, 30V V(RRM), Silicon; Mfr_Name: Toshiba Electronic Devices & Storage Corp.; Manufacturer: Toshiba; Type: DEV; Max Reverse Current: 500uA; Peak Non-Repetitive Surge Current: 5A; Copyright: Copyright (C) 2023 Ultra Librarian. All rights reserved.; Manufacturer_Part_Number: CUS10S30,H3F; RefDes: RefDes; Supplier: Digi-Key; Supplier Part Number: CUS10S30H3FCT-ND; Manufacturer Part Number: CUS10S30,H3F; RoHS: Yes; Category: Rectifier Diodes; Stock: 308991; Pricing: 1=0.35, 10=0.243, 100=0.1228, 500=0.1002, 1000=0.07434 (USD); Mounting Technology: Surface Mount; Case/Package: SOD; Pins: 2; Contact Plating: Tin,Silver; Min Operating Temperature: -55°C; Max Operating Temperature: 125°C; Packaging: Cut Tape; Average Rectified Current: 1A; Max Reverse Voltage (DC): 30V; Series: -; RoHS Compliant: Yes; ComponentLink1URL: http://toshiba.semicon-storage.com/info/lookup.jsp?pid=CUS10S30&amp;lang=en&src-supplier=Mouser; ComponentLink1Description: http://toshiba.semicon-storage.com/info/lookup.jsp?pid=CUS10S30&amp;lang=en&src-supplier=Mouser; ComponentLink2URL: http://toshiba.semicon-storage.com/info/docget.jsp?did=14077&prodName=CUS10S30&src-supplier=Avnet; ComponentLink2Description: http://toshiba.semicon-storage.com/info/docget.jsp?did=14077&prodName=CUS10S30&src-supplier=Avnet; ComponentLink3URL: https://toshiba.semicon-storage.com/info/docget.jsp?did=14077&prodName=CUS10S30&src-supplier=Digi-Key; ComponentLink3Description: https://toshiba.semicon-storage.com/info/docget.jsp?did=14077&prodName=CUS10S30&src-supplier=Digi-Key; LCSC Part#: C146335; Value: CUS10S30,H3F
J1 = TSM-104-01-T-SV: Conn Unshrouded Header HDR 4 POS 2.54mm Solder ST Top Entry SMD Tube; Mfr_Name: Samtec Inc; Manufacturer: Samtec; Number of Contacts: 4; Gender: Male; Max Current Rating: 7A; Max Voltage Rating (AC): 475V; Copyright: Copyright (C) 2023 Ultra Librarian. All rights reserved.; Manufacturer_Part_Number: TSM-104-01-T-SV; RefDes: RefDes; Type: DEV; Supplier: Digi-Key; Supplier Part Number: SAM8983-ND; Manufacturer Part Number: TSM-104-01-T-SV; RoHS: Yes; Category: Headers and Wire Housings; Stock: 1177; Pricing: 1=0.65, 10=0.564, 100=0.4646, 500=0.404, 1000=0.3333, 5000=0.2929, 10000=0.2727 (USD); Mounting Technology: Surface Mount; Contact Plating: Tin; Contact Material: Bronze; Contact Shape: Square; Contact Finish - Mating: TIN; Insulation Material: Polymer; Insulation Color: Black; Housing Color: Black; Housing Material: Polymer; Color: Black; Min Operating Temperature: -55°C; Max Operating Temperature: 105°C; Number of Rows: 1; Packaging: Rail/Tube; Termination: Solder; Number of Positions: 4; Series: TSM; Contact Type: Male Pin; Connector Type: Header; Fastening Type: Pull; Orientation: Straight; Package Quantity: 1; Length: 10.16mm; Pitch: 2.54mm; Depth: 2.54mm; Contact Mating Length: 0.23inch; Radiation Hardening: No; Lead Free: Lead Free; RoHS Compliant: Yes; Flammability Rating: UL94 V-0; Reach SVHC Compliant: No; ComponentLink1URL: https://datasheet.ciiva.com/739/tsm-1xx-xx-xxx-sv-xx-xxx-xx-mkt-739625.pdf?src-supplier=Digi-Key; ComponentLink1Description: https://datasheet.ciiva.com/739/tsm-1xx-xx-xxx-sv-xx-xxx-xx-mkt-739625.pdf?src-supplier=Digi-Key; LCSC Part#: C3335977; Value: TSM-104-01-T-SV
R3 R4 = RC0603JR-13330RL: Res Thick Film 0603 330 Ohm 5% 0.1W(1/10W) ±100ppm/C Pad SMD T/R; Manufacturer: Yageo; Temperature Coefficient: 100ppm/°C; Power Rating: 100mW; Voltage Rating: 50V; Supplier: Digi-Key; Supplier Part Number: 13-RC0603JR-13330RLCT-ND; Manufacturer Part Number: RC0603JR-13330RL; RoHS: Yes; Category: Chip SMD Resistors; Stock: 83710; Pricing: 1=0.1, 10=0.015, 50=0.0092, 100=0.0076, 500=0.00512, 1000=0.00437, 5000=0.00314, 10000=0.00275 (USD); Case/Package: 0603; Contact Plating: Tin,Lead; Case Code (Imperial): 0603; Case Code (Metric): 1608; Min Operating Temperature: -55°C; Max Operating Temperature: 155°C; Value: 330R; Tolerance: 5%; Packaging: Tape and Reel; Termination: SMD/SMT; Series: RC; Length: 1.6mm; Width: 0.8mm; Height: 0.45mm; Lead Free: Lead Free; RoHS Compliant: Yes; ComponentLink1URL: http://www.mouser.com/ds/2/447/RC0603-272842.pdf?src-supplier=Mouser; ComponentLink1Description: http://www.mouser.com/ds/2/447/RC0603-272842.pdf?src-supplier=Mouser; ComponentLink2URL: https://datasheet.octopart.com/RC0603JR-13330RL-Yageo-datasheet-164759695.pdf?src-supplier=Future+Electronics; ComponentLink2Description: https://datasheet.octopart.com/RC0603JR-13330RL-Yageo-datasheet-164759695.pdf?src-supplier=Future+Electronics; ComponentLink3URL: http://www.yageo.com/pdf/PYu-RC0603_51_RoHS_L_4.pdf?src-supplier=Avnet; ComponentLink3Description: http://www.yageo.com/pdf/PYu-RC0603_51_RoHS_L_4.pdf?src-supplier=Avnet; LCSC Part#: C3995110
TP2 TP14 TP15 = TestPoint_1mm
U2 = STM32F042K6T7: ARM® Cortex®-M0 STM32 F0 Microcontroller IC 32-Bit 48MHz 32KB (32K x 8) FLASH 32-LQFP (7x7); Mfr_Name: STMicroelectronics; RAM Size: 6KB; Max Power Dissipation: 351mW; Interface: I2C,SPI,USB,CAN,HDMI,IrDA,UART,USART,LIN,I2S; Number of I/Os: 26; Number of Timers/Counters: 6; Oscillator Type: Internal; Data Bus Width: 32b; Min Supply Voltage: 2V; Max Supply Voltage: 3.6V; Watchdog Timer: Yes; Peripherals: POR,PWM,WDT,DMA; Core Architecture: ARM; Copyright: Copyright (C) 2023 Ultra Librarian. All rights reserved.; Manufacturer_Part_Number: STM32F042K6T7; RefDes: RefDes; Type: DEV; Supplier: Digi-Key; Supplier Part Number: 497-18516-ND; Manufacturer: STMicroelectronics; Manufacturer Part Number: STM32F042K6T7; RoHS: Yes; Category: Microcontrollers; Stock: 2881; Pricing: 1=4.08, 10=3.669, 25=3.4684, 80=3.00588, 250=2.85172, 500=2.55882, 1000=2.15805, 2500=2.05014, 5000=1.97307 (USD); Case/Package: LQFP; Pins: 32; Min Operating Temperature: -40°C; Max Operating Temperature: 105°C; Packaging: Tray; Frequency: 48MHz; Number of Programmable I/O: 26; Clock Frequency: 48MHz; Memory Format: FLASH; Memory Size: 32KB; Series: STM32 F0; Radiation Hardening: No; Reach SVHC Compliant: No; Lead Free: Lead Free; RoHS Compliant: Yes; ComponentLink1URL: http://www.farnell.com/datasheets/2281753.pdf?src-supplier=Farnell; ComponentLink1Description: http://www.farnell.com/datasheets/2281753.pdf?src-supplier=Farnell; ComponentLink2URL: http://www.mouser.com/ds/2/389/stm32f042c4-956225.pdf?src-supplier=Mouser; ComponentLink2Description: http://www.mouser.com/ds/2/389/stm32f042c4-956225.pdf?src-supplier=Mouser; ComponentLink3URL: http://www.st.com/content/ccc/resource/technical/document/datasheet/52/ad/d0/80/e6/be/40/ad/DM00105814.pdf/files/DM00105814.pdf/jcr:content/translations/en.DM00105814.pdf?src-supplier=Digi-Key; ComponentLink3Description: http://www.st.com/content/ccc/resource/technical/document/datasheet/52/ad/d0/80/e6/be/40/ad/DM00105814.pdf/files/DM00105814.pdf/jcr:content/translations/en.DM00105814.pdf?src-supplier=Digi-Key; ComponentLink4URL: http://www.st.com/st-web-ui/static/active/en/resource/technical/document/datasheet/DM00105814.pdf?src-supplier=Avnet; ComponentLink4Description: http://www.st.com/st-web-ui/static/active/en/resource/technical/document/datasheet/DM00105814.pdf?src-supplier=Avnet; ComponentLink5URL: http://www.farnell.com/datasheets/1886881.pdf?src-supplier=Element14; ComponentLink5Description: http://www.farnell.com/datasheets/1886881.pdf?src-supplier=Element14; ComponentLink6URL: http://www.farnell.com/datasheets/2281753.pdf?src-supplier=Newark; ComponentLink6Description: http://www.farnell.com/datasheets/2281753.pdf?src-supplier=Newark; ComponentLink7URL: https://datasheet.octopart.com/STM32F042K6T7-STMicroelectronics-datasheet-62336640.pdf?src-supplier=LKR; ComponentLink7Description: https://datasheet.octopart.com/STM32F042K6T7-STMicroelectronics-datasheet-62336640.pdf?src-supplier=LKR; ComponentLink8URL: https://datasheet.octopart.com/STM32F042K6T7-STMicroelectronics-datasheet-82511004.pdf?src-supplier=SHENGYU+ELECTRONICS; ComponentLink8Description: https://datasheet.octopart.com/STM32F042K6T7-STMicroelectronics-datasheet-82511004.pdf?src-supplier=SHENGYU+ELECTRONICS; LCSC Part#: C1337340; Value: STM32F042K6T7
XTAL1 = XC53G2-8.000-F12NJHP: CRYSTAL 8MHZ 12PF SMD; Mfr_Name: HCI; Copyright: Copyright (C) 2023 Ultra Librarian. All rights reserved.; Manufacturer_Part_Number: XC53G2-8.000-F12NJHPK; RefDes: RefDes; Type: DEV; Value: XC53G2-8.000-F12NJHPK; LCSC Part#: C2842269

## Sheet BoardIF.SchDoc
size A; SheetNumber: 4; SheetTotal: 7
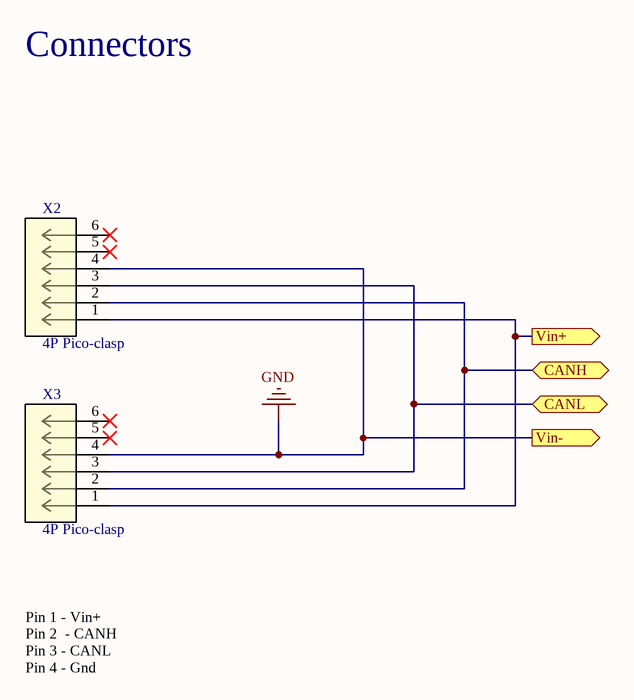
[diagram p3: BoardIF.SchDoc]

### Parts
X2  4P Pico-clasp  [CON_2023960407]
X3  4P Pico-clasp  [CON_2023960407]

### Ports
CANH (bidir, see CAN_TxRx[4B]), CANL (bidir, see CAN_TxRx[4C]), Vin+ (out, see PowerReg[1B]), Vin- (out)

### Nets
GND: X2.4 X3.4 ; port Vin-
NetC13_1: X2.1 X3.1 ; port Vin+
NetSW1_2: X2.3 X3.3 ; port CANL
NetSW1_5: X2.2 X3.2 ; port CANH

Not connected (* = marked no-connect by the designer): X2 5* 6*; X3 5* 6*

### Notes on the sheet
- Connectors
- Pin 1 - Vin+
  Pin 2  - CANH
  Pin 3 - CANL
  Pin 4 - Gnd

### Library data of the parts
X2 X3 = 202396-0407: Conn Shrouded Header (4 Sides) HDR 4 POS 1mm Solder RA SMD Pico-Clasp™ T/R; Manufacturer: Molex; Number of Positions: 4; Value: 2023960407; Supplier: Digi-Key; Supplier Part Number: WM26785CT-ND; Manufacturer Part Number: 202396-0407; RoHS: No; Category: Headers and Wire Housings; Stock: 4338; Pricing: 1=1.05, 10=0.869, 100=0.7238 (USD); Mounting Technology: Surface Mount; Contact Material: Bronze; Contact Shape: Square; Insulation Material: Nylon; Insulation Color: Natural; Contact Finish - Mating: GOLD; Min Operating Temperature: -40°C; Max Operating Temperature: 105°C; Connector Type: Header; Fastening Type: Latch; Packaging: Tape and Reel; Number of Rows: 1; Termination: Solder; Series: Pico-Clasp 202396; Contact Type: Male Pin; Flammability Rating: UL94 V-0; ComponentLink1URL: http://datasheet.octopart.com/202396-0407-Molex-datasheet-134623761.pdf?src-supplier=Avnet; ComponentLink1Description: http://datasheet.octopart.com/202396-0407-Molex-datasheet-134623761.pdf?src-supplier=Avnet; ComponentLink2URL: https://www.molex.com/pdm_docs/sd/2023960407_sd.pdf?src-supplier=Digi-Key; ComponentLink2Description: https://www.molex.com/pdm_docs/sd/2023960407_sd.pdf?src-supplier=Digi-Key; ComponentLink3URL: http://datasheet.octopart.com/202396-0407-Molex-datasheet-134623761.pdf?src-supplier=Digi-Key; ComponentLink3Description: http://datasheet.octopart.com/202396-0407-Molex-datasheet-134623761.pdf?src-supplier=Digi-Key; ComponentLink4URL: http://datasheet.octopart.com/202396-0407-Molex-datasheet-134623761.pdf?src-supplier=Farnell; ComponentLink4Description: http://datasheet.octopart.com/202396-0407-Molex-datasheet-134623761.pdf?src-supplier=Farnell; ComponentLink5URL: http://datasheet.octopart.com/202396-0407-Molex-datasheet-134623761.pdf?src-supplier=Newark; ComponentLink5Description: http://datasheet.octopart.com/202396-0407-Molex-datasheet-134623761.pdf?src-supplier=Newark; ComponentLink6URL: http://datasheet.octopart.com/202396-0407-Molex-datasheet-134623761.pdf?src-supplier=Mouser; ComponentLink6Description: http://datasheet.octopart.com/202396-0407-Molex-datasheet-134623761.pdf?src-supplier=Mouser; ComponentLink7URL: http://datasheet.octopart.com/202396-0407-Molex-datasheet-134623761.pdf?src-supplier=Heilind+Electronics; ComponentLink7Description: http://datasheet.octopart.com/202396-0407-Molex-datasheet-134623761.pdf?src-supplier=Heilind+Electronics; ComponentLink8URL: http://datasheet.octopart.com/202396-0407-Molex-datasheet-134623761.pdf?src-supplier=Electro+Sonic; ComponentLink8Description: http://datasheet.octopart.com/202396-0407-Molex-datasheet-134623761.pdf?src-supplier=Electro+Sonic; LCSC Part#: *